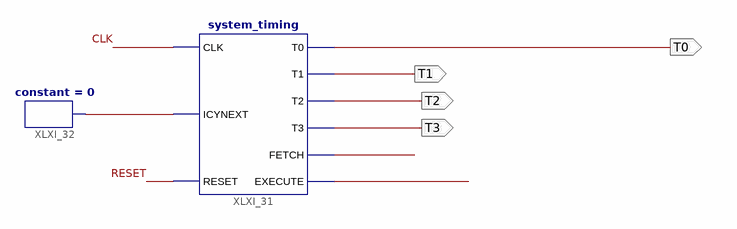
[diagram p0: schematic sheet 1]
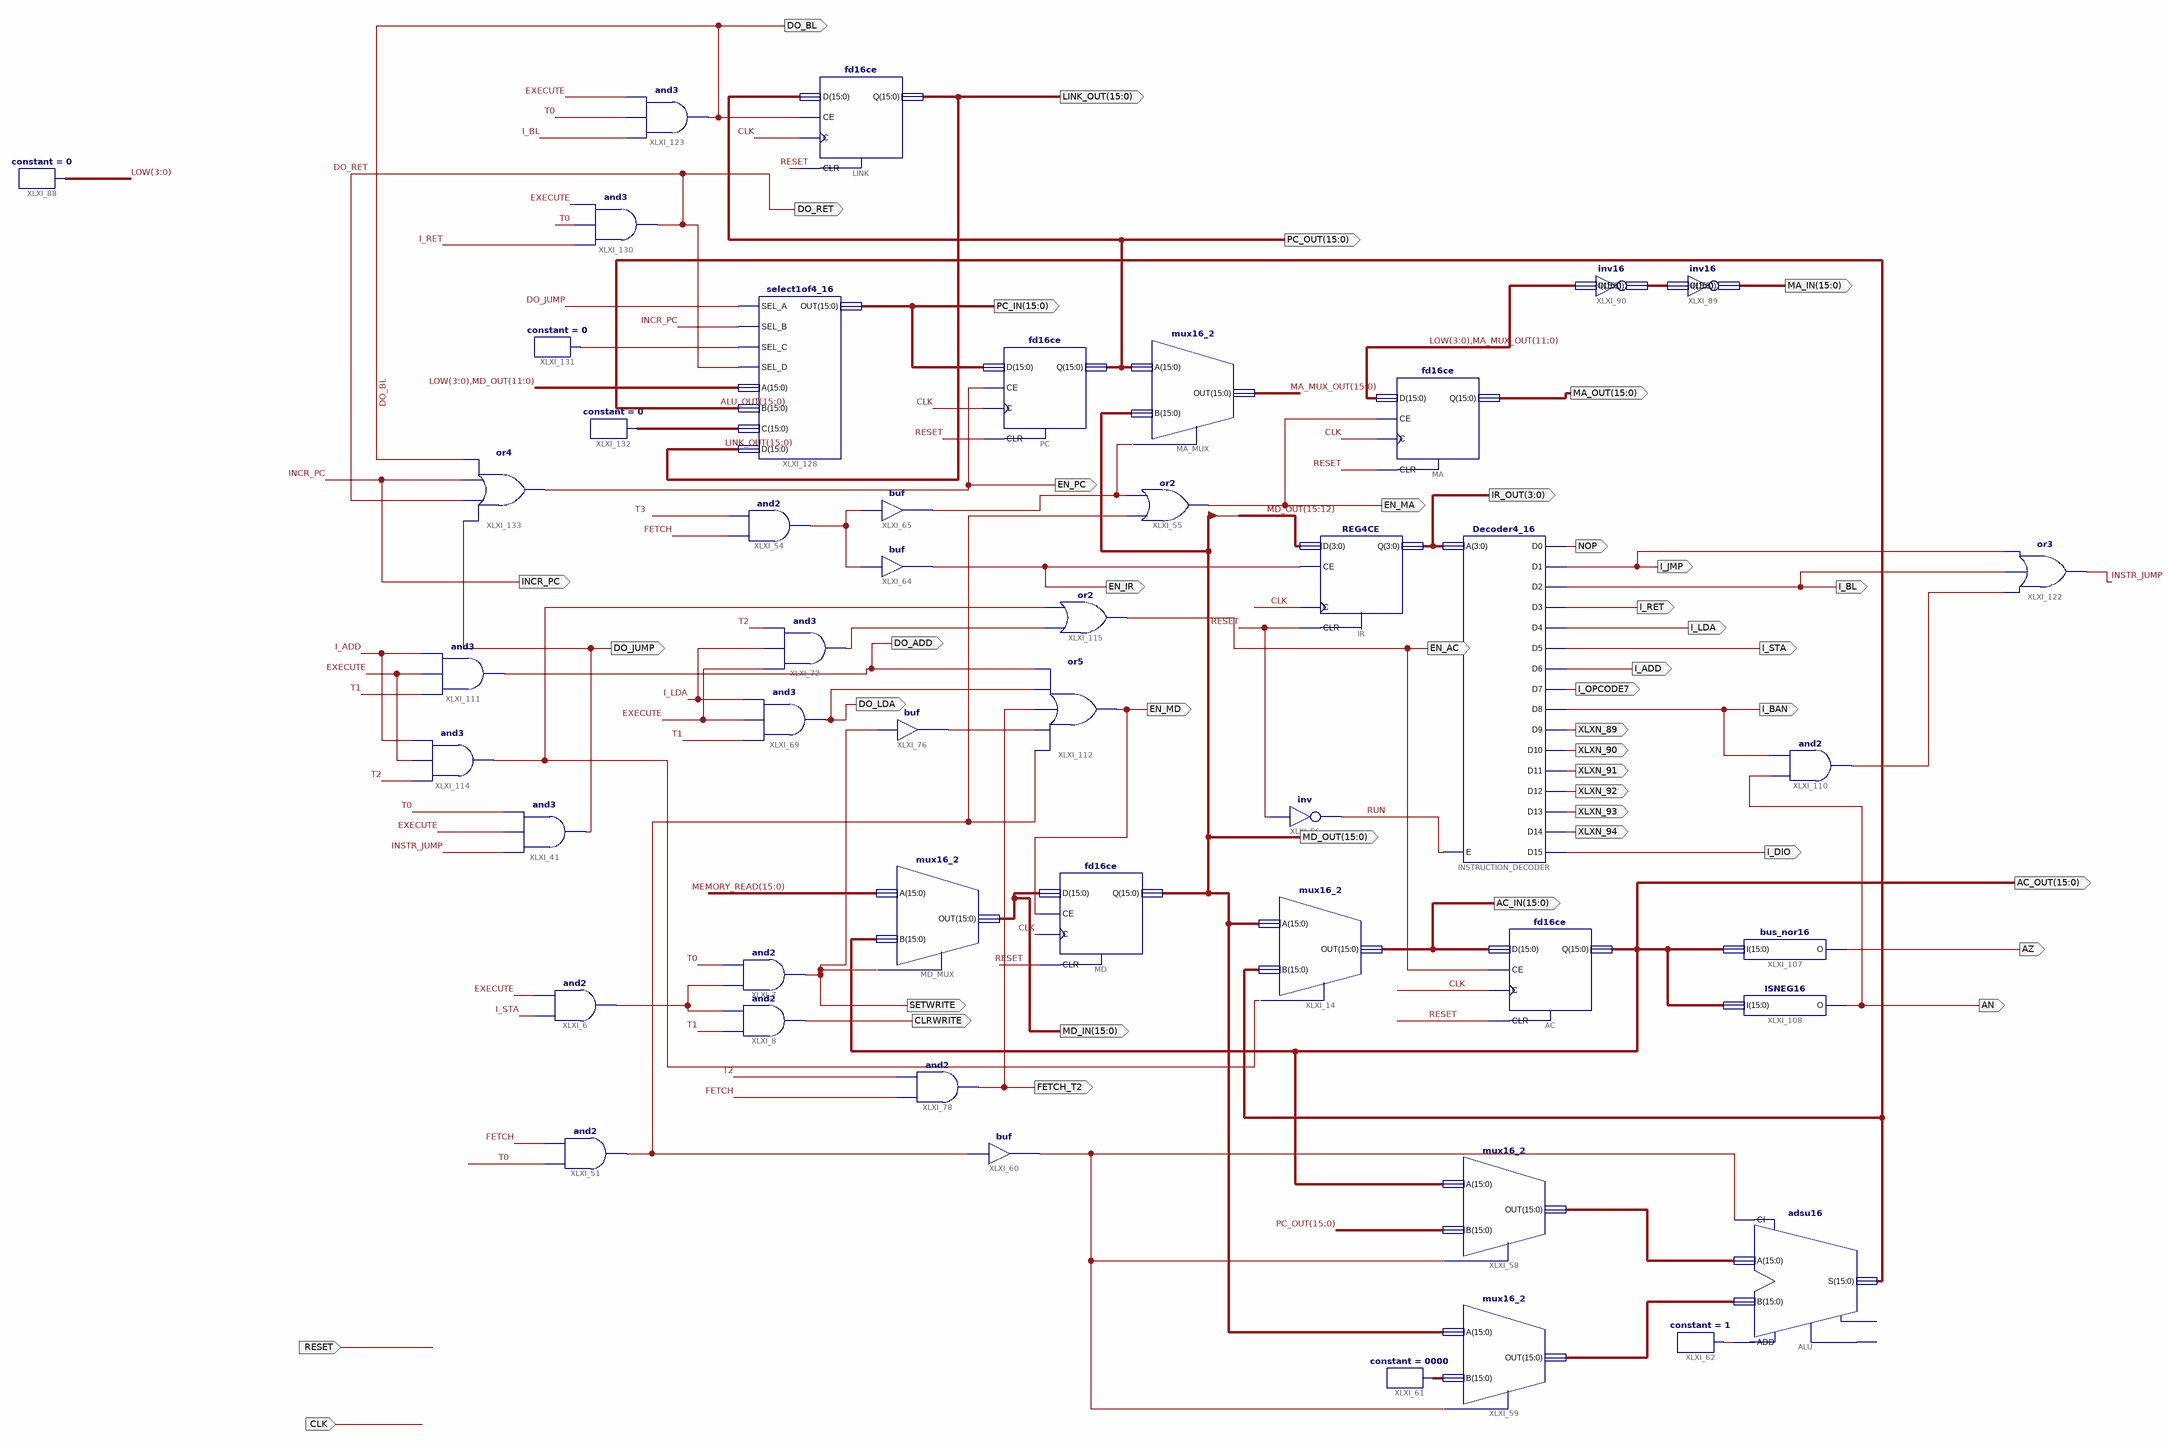
[diagram p1: schematic sheet 2]
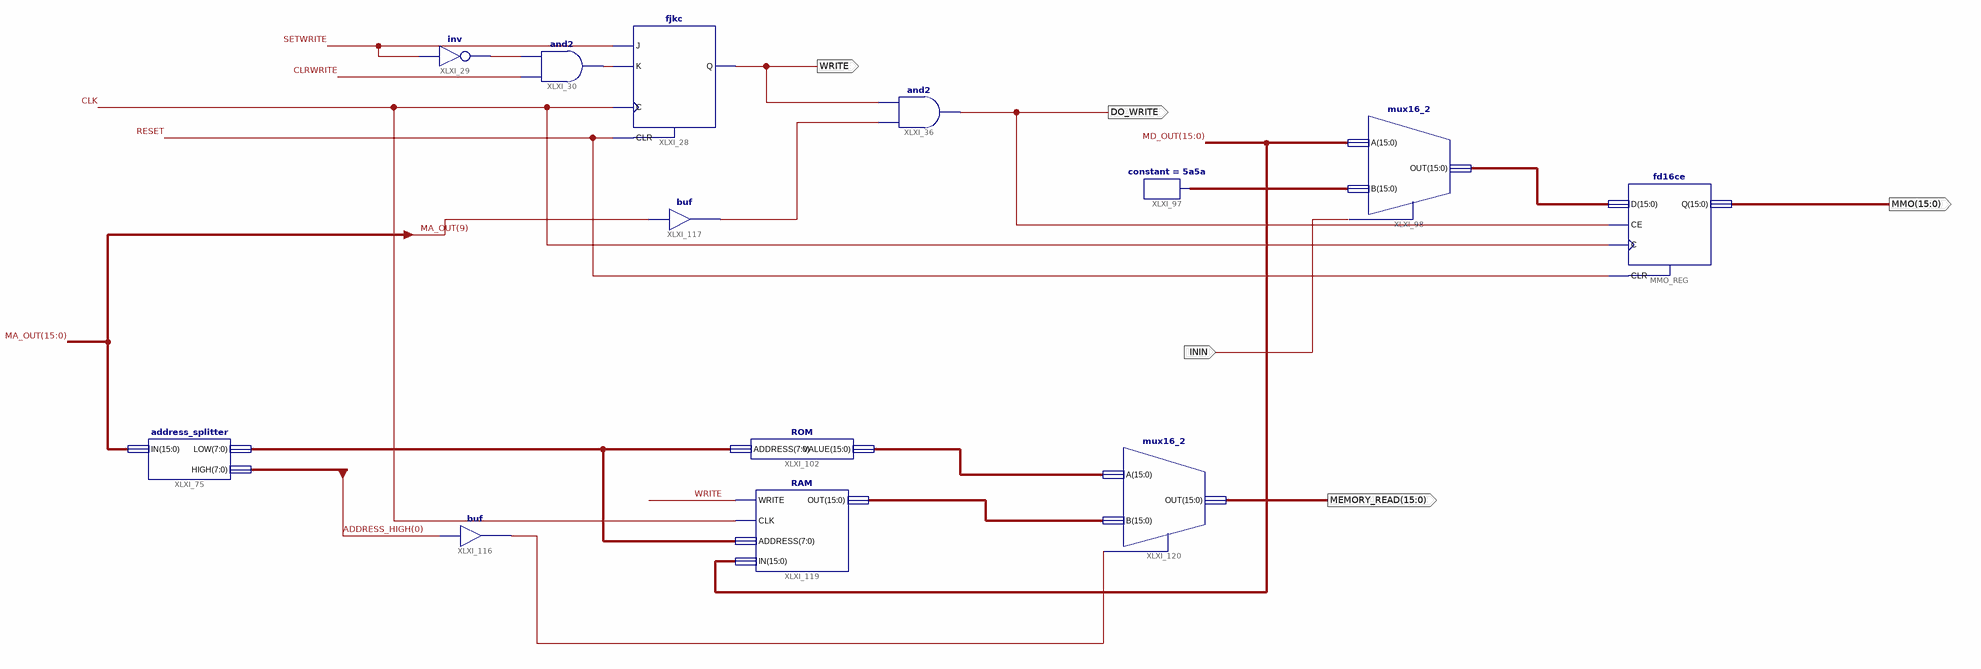
[diagram p2: schematic sheet 3]
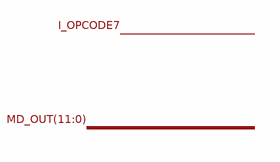
[diagram p3: schematic sheet 4]
// Xilinx ISE schematic dunc16.sch (spartan6) as structural Verilog: 62 symbols, 54 ports
module dunc16 (
  input  CLK,
  input  RESET,
  input  ININ,
  output I_STA,
  output SETWRITE,
  output CLRWRITE,
  output [15:0] MD_IN,
  output [15:0] AC_OUT,
  output [15:0] MD_OUT,
  output [3:0] IR_OUT,
  output EN_MD,
  output WRITE,
  output T0,
  output T1,
  output [15:0] MA_OUT,
  output DO_WRITE,
  output [15:0] MMO,
  output I_JMP,
  output I_LDA,
  output NOP,
  output I_BL,
  output I_RET,
  output I_ADD,
  output I_OPCODE7,
  output I_BAN,
  output XLXN_89,
  output XLXN_90,
  output XLXN_91,
  output XLXN_92,
  output XLXN_93,
  output XLXN_94,
  output I_DIO,
  output [15:0] MEMORY_READ,
  output T2,
  output T3,
  output [15:0] PC_OUT,
  output [15:0] PC_IN,
  output EN_MA,
  output INCR_PC,
  output EN_IR,
  output FETCH_T3,
  output DO_LDA,
  output EN_AC,
  output [15:0] AC_IN,
  output EN_PC,
  output [15:0] MA_IN,
  output AZ,
  output AN,
  output FETCH_T2,
  output DO_ADD,
  output DO_BL,
  output [15:0] LINK_OUT,
  output DO_JUMP,
  output DO_RET
);

  wire ADDR_FROM_MD, ADDR_FROM_PC, DO_BRANCH, ENABLE_MMO_DEVICE, EXECUTE, FETCH, INSTR_JUMP, RUN, STA_T0,
       XLXN_5, XLXN_48, XLXN_49, XLXN_62, XLXN_155, XLXN_320, XLXN_328, XLXN_343, XLXN_439;
  wire [3:0] LOW;
  wire [7:0] ADDRESS_HIGH, XLXN_220;
  wire [15:0] ALU_OUT, MA_MUX_OUT, XLXN_147, XLXN_148, XLXN_151, XLXN_271, XLXN_279, XLXN_283, XLXN_341,
       XLXN_342, XLXN_440;

  fd16ce MD (.C(CLK), .CE(EN_MD), .CLR(RESET), .D(MD_IN), .Q(MD_OUT));
  and XLXI_6 (XLXN_5, I_STA, EXECUTE);
  and XLXI_7 (SETWRITE, XLXN_5, T0);
  and XLXI_8 (CLRWRITE, T1, XLXN_5);
  mux16_2 MD_MUX (.B(AC_OUT), .A(MEMORY_READ), .SEL(SETWRITE), .OUT(MD_IN));
  Decoder4_16 INSTRUCTION_DECODER (
    .D0(NOP), .D1(I_JMP), .D2(I_BL), .D3(I_RET), .D4(I_LDA), .D5(I_STA), .D6(I_ADD), .D7(I_OPCODE7),
    .D8(I_BAN), .D9(XLXN_89), .D10(XLXN_90), .D11(XLXN_91), .D12(XLXN_92), .D13(XLXN_93), .D14(XLXN_94),
    .D15(I_DIO), .E(RUN), .A(IR_OUT));
  fd16ce AC (.C(CLK), .CE(EN_AC), .CLR(RESET), .D(AC_IN), .Q(AC_OUT));
  mux16_2 XLXI_14 (.B(ALU_OUT), .A(MD_OUT), .SEL(XLXN_320), .OUT(AC_IN));
  REG4CE IR (.CE(EN_IR), .Q(IR_OUT), .D(MD_OUT[15:12]), .C(CLK), .CLR(RESET));
  fjkc XLXI_28 (.C(CLK), .CLR(RESET), .J(SETWRITE), .K(XLXN_48), .Q(WRITE));
  not XLXI_29 (XLXN_49, SETWRITE);
  and XLXI_30 (XLXN_48, CLRWRITE, XLXN_49);
  fd16ce MA (.C(CLK), .CE(EN_MA), .CLR(RESET), .D({LOW, MA_MUX_OUT[11:0]}), .Q(MA_OUT));
  and XLXI_36 (DO_WRITE, ENABLE_MMO_DEVICE, WRITE);
  fd16ce MMO_REG (.C(CLK), .CE(DO_WRITE), .CLR(RESET), .D(XLXN_283), .Q(MMO));
  and XLXI_41 (DO_JUMP, INSTR_JUMP, EXECUTE, T0);
  fd16ce PC (.C(CLK), .CE(EN_PC), .CLR(RESET), .D(PC_IN), .Q(PC_OUT));
  mux16_2 MA_MUX (.B(MD_OUT), .A(PC_OUT), .SEL(ADDR_FROM_MD), .OUT(MA_MUX_OUT));
  and XLXI_51 (ADDR_FROM_PC, T0, FETCH);
  and XLXI_54 (FETCH_T3, FETCH, T3);
  or XLXI_55 (EN_MA, ADDR_FROM_PC, ADDR_FROM_MD);
  not XLXI_56 (RUN, RESET);
  adsu16 ALU (.A(XLXN_147), .ADD(XLXN_155), .B(XLXN_148), .CI(INCR_PC), .S(ALU_OUT));  // open: CO, OFL
  mux16_2 XLXI_58 (.B(PC_OUT), .A(AC_OUT), .SEL(INCR_PC), .OUT(XLXN_147));
  mux16_2 XLXI_59 (.B(XLXN_151), .A(MD_OUT), .SEL(INCR_PC), .OUT(XLXN_148));
  buf XLXI_60 (INCR_PC, ADDR_FROM_PC);
  constant #(.CValue("0000")) XLXI_61 (.O(XLXN_151));
  constant #(.CValue("1")) XLXI_62 (.O(XLXN_155));
  buf XLXI_64 (EN_IR, FETCH_T3);
  buf XLXI_65 (ADDR_FROM_MD, FETCH_T3);
  and XLXI_69 (DO_LDA, T1, EXECUTE, I_LDA);
  and XLXI_72 (XLXN_328, EXECUTE, I_LDA, T2);
  address_splitter XLXI_75 (.IN(MA_OUT), .LOW(XLXN_220), .HIGH(ADDRESS_HIGH));
  buf XLXI_76 (STA_T0, SETWRITE);
  and XLXI_78 (FETCH_T2, FETCH, T2);
  inv16 XLXI_89 (.I(XLXN_271), .O(MA_IN));
  inv16 XLXI_90 (.I({LOW, MA_MUX_OUT[11:0]}), .O(XLXN_271));
  constant #(.CValue("5a5a")) XLXI_97 (.O(XLXN_279));
  mux16_2 XLXI_98 (.B(XLXN_279), .A(MD_OUT), .SEL(ININ), .OUT(XLXN_283));
  ROM XLXI_102 (.ADDRESS(XLXN_220), .VALUE(XLXN_341));
  system_timing XLXI_31 (
    .CLK(CLK), .ICYNEXT(XLXN_62), .RESET(RESET), .T0(T0), .T1(T1), .T2(T2), .T3(T3), .FETCH(FETCH),
    .EXECUTE(EXECUTE));
  constant #(.CValue("0")) XLXI_32 (.O(XLXN_62));
  bus_nor16 XLXI_107 (.I(AC_OUT), .O(AZ));
  ISNEG16 XLXI_108 (.I(AC_OUT), .O(AN));
  and XLXI_110 (DO_BRANCH, AN, I_BAN);
  and XLXI_111 (DO_ADD, T1, EXECUTE, I_ADD);
  or XLXI_112 (EN_MD, ADDR_FROM_PC, STA_T0, FETCH_T2, DO_LDA, DO_ADD);
  and XLXI_114 (XLXN_320, T2, EXECUTE, I_ADD);
  or XLXI_115 (EN_AC, XLXN_328, XLXN_320);
  buf XLXI_116 (XLXN_343, ADDRESS_HIGH[0]);
  buf XLXI_117 (ENABLE_MMO_DEVICE, MA_OUT[9]);
  RAM XLXI_119 (.WRITE(WRITE), .CLK(CLK), .ADDRESS(XLXN_220), .IN(MD_OUT), .OUT(XLXN_342));
  mux16_2 XLXI_120 (.B(XLXN_342), .A(XLXN_341), .SEL(XLXN_343), .OUT(MEMORY_READ));
  fd16ce LINK (.C(CLK), .CE(DO_BL), .CLR(RESET), .D(PC_OUT), .Q(LINK_OUT));
  or XLXI_122 (INSTR_JUMP, DO_BRANCH, I_BL, I_JMP);
  and XLXI_123 (DO_BL, I_BL, T0, EXECUTE);
  constant #(.CValue("0")) XLXI_88 (.O(LOW));
  select1of4_16 XLXI_128 (
    .SEL_A(DO_JUMP), .SEL_B(INCR_PC), .SEL_C(XLXN_439), .SEL_D(DO_RET), .A({LOW, MD_OUT[11:0]}), .B(ALU_OUT),
    .C(XLXN_440), .D(LINK_OUT), .OUT(PC_IN));
  and XLXI_130 (DO_RET, I_RET, T0, EXECUTE);
  constant #(.CValue("0")) XLXI_131 (.O(XLXN_439));
  constant #(.CValue("0")) XLXI_132 (.O(XLXN_440));
  or XLXI_133 (EN_PC, DO_JUMP, DO_RET, INCR_PC, DO_BL);
endmodule
